# Altium project RPI GPIO BOARD.PrjPcb
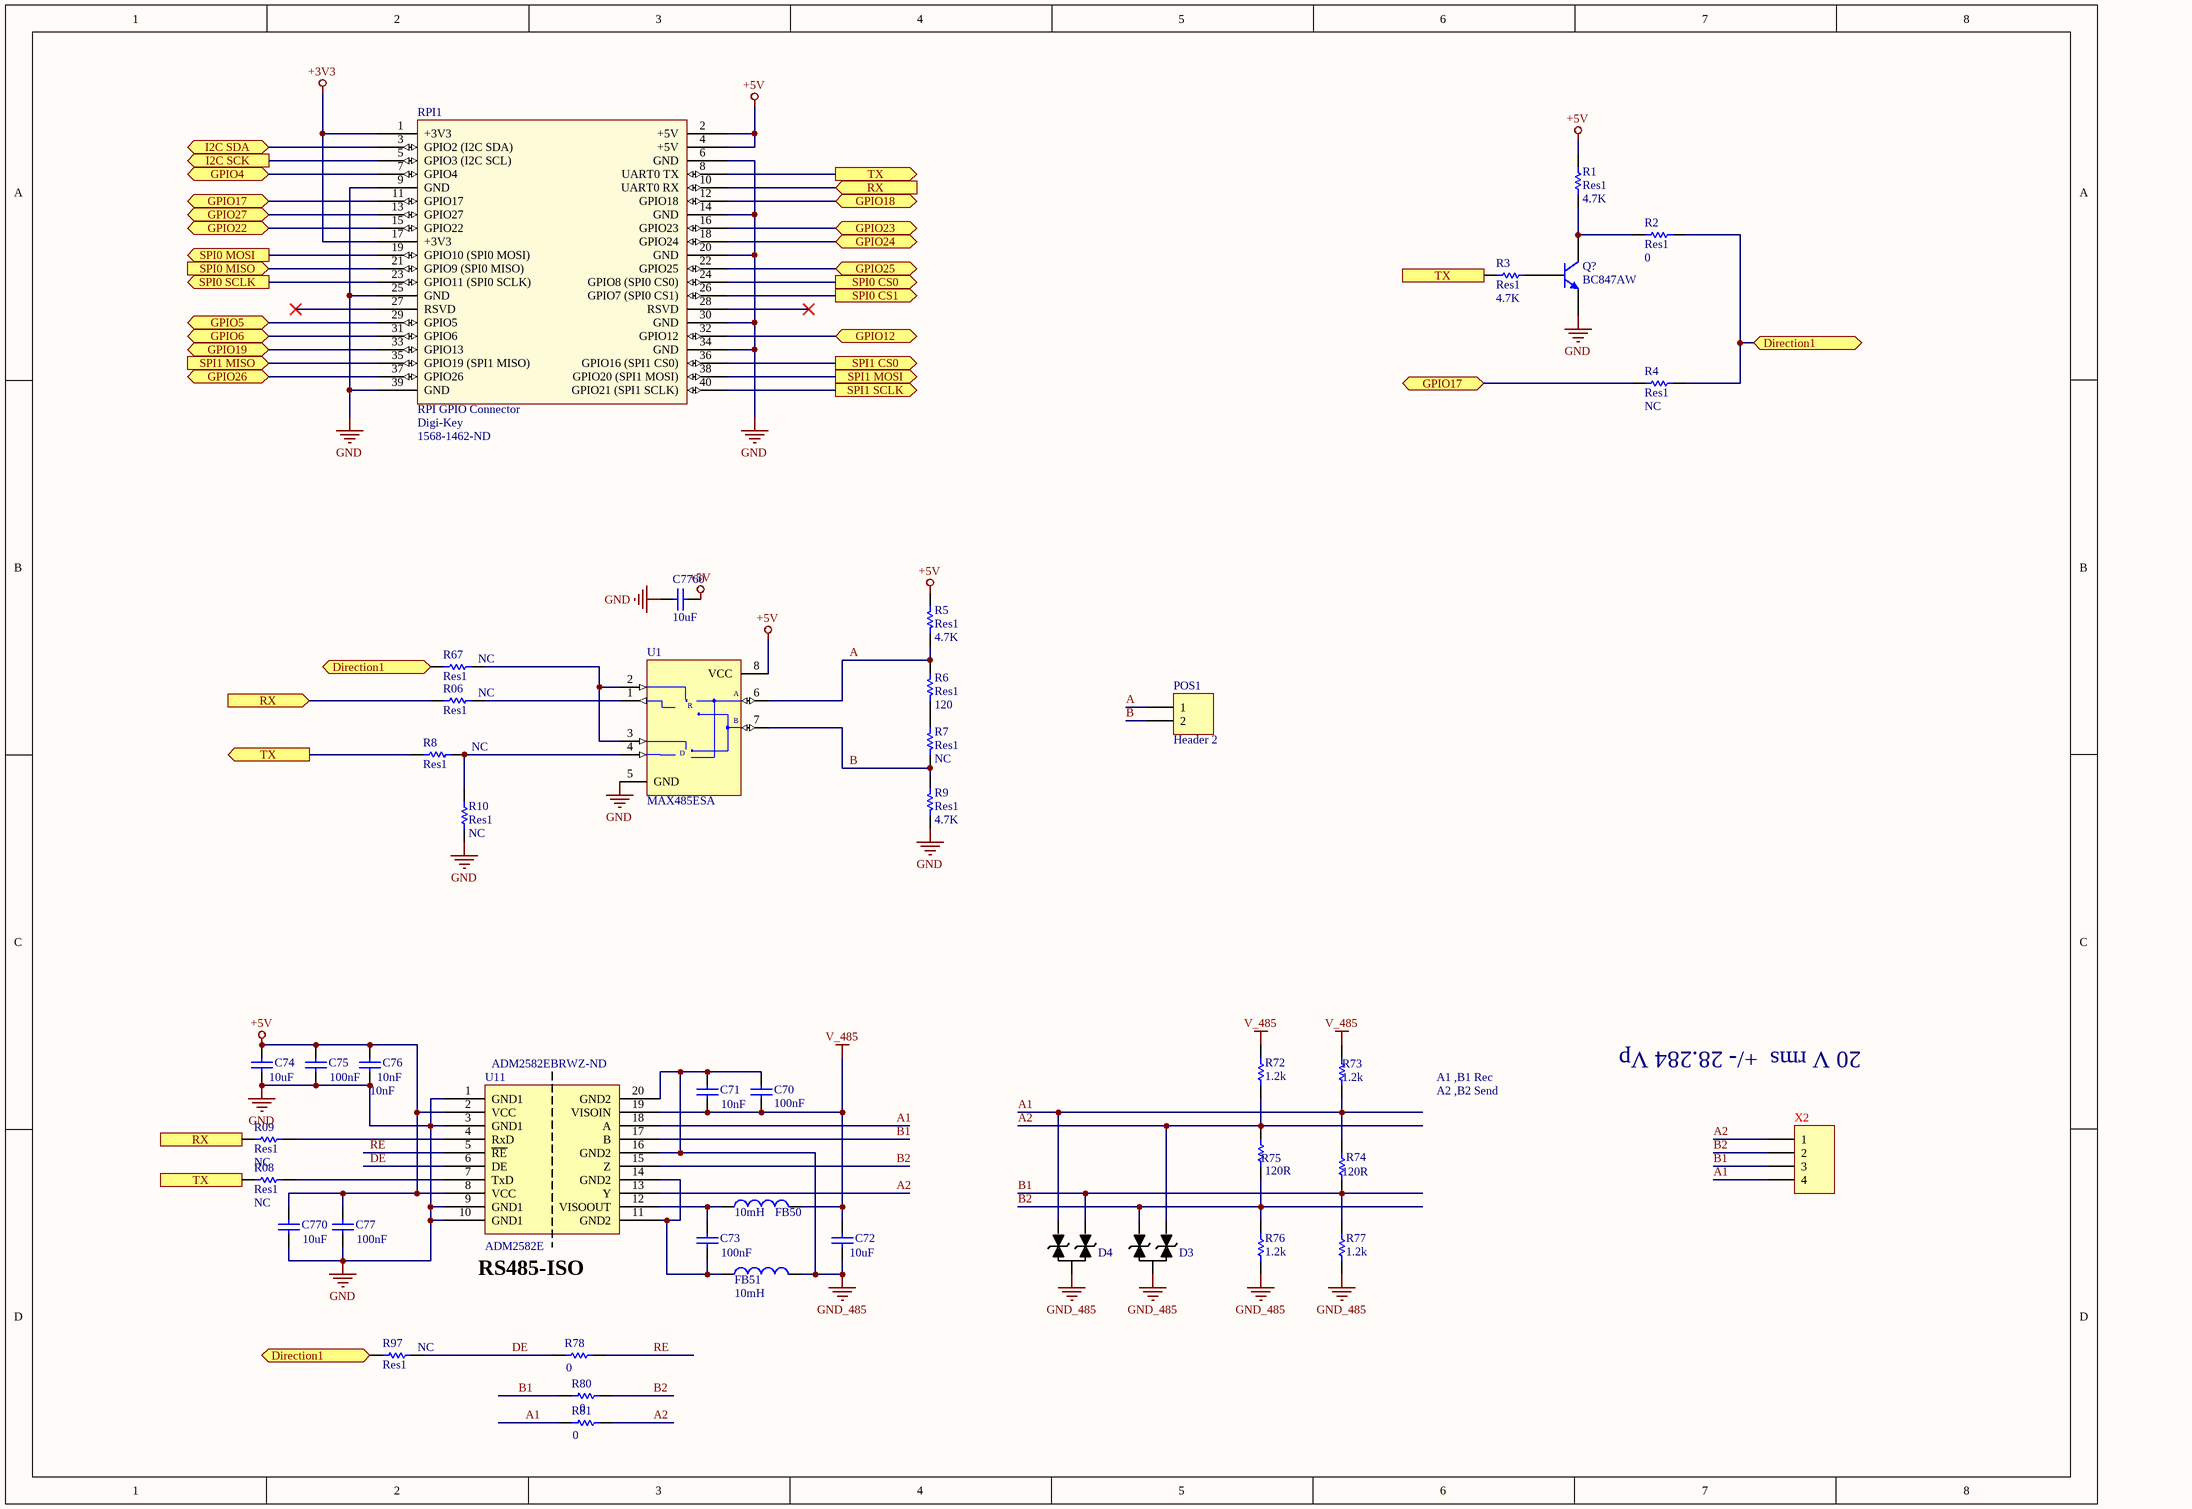
[diagram p0: RPI 3.SchDoc]
mProjectAuthor: Nils Minor; mProjectName: RPI BOARD; mProjectRevision: 0; mProjectVersion: 1
1 sheet, 44 parts. Net scope: flat (ports and power ports of the same name join across sheets).
Board file: RPI 3.PcbDoc

## Sheet RPI 3.SchDoc
size A3; SheetNumber: 1; SheetTotal: 1

### Parts
C70  value 100nF  [0603_LGP]  (hidden comment: 1nF)
C71  10nF  [1206]
C72  10uf  [1206]
C73  100nF  [0603_LGP]
C74  10uF  [1206]
C75  100nF  [0603_LGP]
C76  10nF  [0603_LGP]
C77  100nF  [0603_LGP]
C770  10uF  [0603_LGP]
C7760  10uF  [0603_LGP]
D3  CDSOT23-SM712  [SOT-23A_N]  (value not drawn)
D4  CDSOT23-SM712  [SOT-23A_N]  (value not drawn)
FB50  value 10mH  [0603_LGP]
FB51  value 10mH  [0603_LGP]
POS1  Header 2  [PHOENIX_RIGHT_A_2]
Q?  BC847AW  [SOT-23A_N]
R1  Res1  value 4.7K  [0603_LGP]
R2  Res1  value 0  [0603_LGP]
R3  Res1  value 4.7K  [0603_LGP]
R4  Res1  value NC  [0603_LGP]
R5  Res1  value 4.7K  [1206]
R6  Res1  value 120  [1206]
R06  Res1  value NC  [0603_LGP]
R7  Res1  value NC  [1206]
R8  Res1  value NC  [0603_LGP]
R08  Res1  value NC  [0603_LGP]
R9  Res1  value 4.7K  [1206]
R09  Res1  value NC  [0603_LGP]
R10  Res1  value NC  [0603_LGP]
R67  Res1  value NC  [0603_LGP]
R72  1.2k  [0603_LGP]
R73  1.2k  [0603_LGP]
R74  120R  [0603_LGP]
R75  120R  [0603_LGP]
R76  1.2k  [0603_LGP]
R77  1.2k  [0603_LGP]
R78  0  [0603_LGP]
R80  0  [0603_LGP]
R81  0  [0603_LGP]
R97  Res1  value NC  [0603_LGP]
RPI1  RPI GPIO Connector  Supplier 1: Digi-Key  Supplier Part Number 1: 1568-1462-ND  [rpi]
U1  MAX485ESA  [NSO8_N]
U11  ADM2582E  Supplier Part Number 1: ADM2582EBRWZ-ND  [SO20_W]
X2  1757268  [PHOENIX_RIGHT_A_4]  (value not drawn)

### Ports
Direction1, GPIO4 (bidir), GPIO5 (bidir), GPIO6 (bidir), GPIO12 (bidir), GPIO17 (bidir), GPIO18 (bidir), GPIO19 (bidir), GPIO22 (bidir), GPIO23 (bidir), GPIO24 (bidir), GPIO25 (bidir), GPIO26 (bidir), GPIO27 (bidir), I2C SCK (out), I2C SDA (bidir), RX (in), SPI0 CS0 (out), SPI0 CS1 (out), SPI0 MISO (in), SPI0 MOSI (out), SPI0 SCLK (out), SPI1 CS0 (out), SPI1 MISO (in), SPI1 MOSI (out), SPI1 SCLK (out), TX (out)

### Nets
+3V3: RPI1.1(+3V3) RPI1.17(+3V3)
+5V: C74.1 C75.2 C76.2 C77.2 C770.2 C7760.1 R1.2 R5.2 RPI1.2(+5V) RPI1.4(+5V) U1.8(VCC) U11.2(VCC) U11.8(VCC)
GND: C74.2 C75.1 C76.1 C77.1 C770.1 C7760.2 Q?.2(E) R9.1 R10.2 RPI1.6(GND) RPI1.9(GND) RPI1.14(GND) RPI1.20(GND) RPI1.25(GND) RPI1.30(GND) RPI1.34(GND) RPI1.39(GND) U1.5(GND) U11.1(GND1) U11.3(GND1) U11.9(GND1) U11.10(GND1)
GND_485: C70.2 C71.1 C72.2 D3.3 D4.3 FB51.2 R76.2 R77.2 U11.16(GND2) U11.20(GND2)
V_485: C70.1 C71.2 C72.1 FB50.2 R72.2 R73.2 U11.19(VISOIN)
A: POS1.1 R5.1 R6.2 U1.6(A)
A1: D4.1 R73.1 R74.2 R81.1 U11.18(A) X2.4
A2: D3.2 R72.1 R75.1 R81.2 U11.13(Y) X2.1
B: POS1.2 R7.1 R9.2 U1.7(B)
B1: D4.2 R74.1 R77.1 R80.1 U11.17(B) X2.3
B2: D3.1 R75.2 R76.1 R80.2 U11.15(Z) X2.2
DE: R78.1 R97.2 U11.6(DE)
RE: R78.2 U11.5(~{RE})
NetC73_1: C73.1 FB50.1 U11.12(VISOOUT)
NetC73_2: C73.2 FB51.1 U11.11(GND2) U11.14(GND2)
NetQ?_1: Q?.1(B) R3.2
NetQ?_3: Q?.3(C) R1.1 R2.2
NetR2_1: R2.1 R4.2 R67.1 R97.1 ; port Direction1
NetR3_1: R3.1 R8.1 R08.1 RPI1.8(UART0_TX) ; port TX
NetR4_1: R4.1 RPI1.11(GPIO17) ; port GPIO17
NetR06_1: R06.1 R09.1 RPI1.10(UART0_RX) ; port RX
NetR6_1: R6.1 R7.2
NetR06_2: R06.2 U1.1(RO)
NetR8_2: R8.2 R10.1 U1.4(DI)
NetR08_2: R08.2 U11.7(TxD)
NetR09_2: R09.2 U11.4(RxD)
NetR67_2: R67.2 U1.2(~{RE}) U1.3(DE)
NetRPI1_3: RPI1.3(GPIO2_(I2C_SDA)) ; port I2C SDA
NetRPI1_5: RPI1.5(GPIO3_(I2C_SCL)) ; port I2C SCK
NetRPI1_7: RPI1.7(GPIO4) ; port GPIO4
NetRPI1_12: RPI1.12(GPIO18) ; port GPIO18
NetRPI1_13: RPI1.13(GPIO27) ; port GPIO27
NetRPI1_15: RPI1.15(GPIO22) ; port GPIO22
NetRPI1_16: RPI1.16(GPIO23) ; port GPIO23
NetRPI1_18: RPI1.18(GPIO24) ; port GPIO24
NetRPI1_19: RPI1.19(GPIO10_(SPI0_MOSI)) ; port SPI0 MOSI
NetRPI1_21: RPI1.21(GPIO9_(SPI0_MISO)) ; port SPI0 MISO
NetRPI1_22: RPI1.22(GPIO25) ; port GPIO25
NetRPI1_23: RPI1.23(GPIO11_(SPI0_SCLK)) ; port SPI0 SCLK
NetRPI1_24: RPI1.24(GPIO8_(SPI0_CS0)) ; port SPI0 CS0
NetRPI1_26: RPI1.26(GPIO7_(SPI0_CS1)) ; port SPI0 CS1
NetRPI1_29: RPI1.29(GPIO5) ; port GPIO5
NetRPI1_31: RPI1.31(GPIO6) ; port GPIO6
NetRPI1_32: RPI1.32(GPIO12) ; port GPIO12
NetRPI1_33: RPI1.33(GPIO13) ; port GPIO19
NetRPI1_35: RPI1.35(GPIO19_(SPI1_MISO)) ; port SPI1 MISO
NetRPI1_36: RPI1.36(GPIO16_(SPI1_CS0)) ; port SPI1 CS0
NetRPI1_37: RPI1.37(GPIO26) ; port GPIO26
NetRPI1_38: RPI1.38(GPIO20_(SPI1_MOSI)) ; port SPI1 MOSI
NetRPI1_40: RPI1.40(GPIO21_(SPI1_SCLK)) ; port SPI1 SCLK

Not connected (* = marked no-connect by the designer): RPI1 27(RSVD)* 28(RSVD)*

### Notes on the sheet
- 20 V rms  +/- 28.284 Vp
- A1 ,B1 Rec
- A2 ,B2 Send
- (near U11) RS485-ISO
- (in symbol MAX485ESA) R; D

### Library data of the parts
C70 = Cap Semi: Multilayer Ceramic Capacitors MLCC - SMD/SMT 16volts 0.1uF 5% X7R; Manufacturer: KEMET; Manufacturer Part Number: C0603C104J4RAC; Part # Aliases: C0603C104J4RAC7867; Capacitance - nF: 100 nF; Capacitance - pF: 100000 pF; Case Height: 0.8 mm; Case Length: 1.6 mm; Class: Class 1; Dissipation Factor DF: 3.5; Voltage Rating: 16 V; Temperature Coefficient / Code: +/- 15 %; Type: SMD MLCC X7R 6.3 - 250 VDC Commerical Grade; Published: 8-Jun-2000; LatestRevisionDate: 29-May-2009; LatestRevisionNote: IPC-7351 Footprint Added.; PackageReference: C1206; Publisher: Altium Limited; PackageDescription: Chip Capacitor; Supplier 1: Arrow; Supplier Part Number 1: C0603C104J4RAC; Stock 1: 96; Pricing 1: 1=0.09, 10=0.0816, 100=0.0801, 500=0.0795 (USD); Brand: Kemet; Capacitance: 0.1 uF; Case Code - in: 0603; Case Code - mm: 1608; Dimensions: 0.8 mm W x 1.6 mm L x 0.8 mm H; Dielectric: X7R; Case Width: 0.8 mm; Factory Pack Quantity: 4000; Product Category: Multilayer Ceramic Capacitors MLCC - SMD/SMT; RoHS: Details; Tolerance: 5 %; Minimum Operating Temperature: - 55 C; Maximum Operating Temperature: + 125 C; Product: General Type MLCCs; Operating Temperature Range: - 55 C to + 125 C; Package / Case: 0603 (1608 metric); Packaging: Reel; Series: C0603C; Termination Style: SMD/SMT; Voltage Rating DC: 16 V; ComponentLink1URL: http://www.kemet.com/Lists/ProductCatalog/Attachments/53/KEM_C1002_X7R_SMD.pdf; ComponentLink1Description: http://www.kemet.com/Lists/ProductCatalog/Attachments/53/KEM_C1002_X7R_SMD.pdf
C71 C76 = Cap: Cap Ceramic 0.01uF 25V X7R 10% SMD 0603 125C Paper T/R; Manufacturer: KEMET; Manufacturer Part Number: C0603C103K3RACTU; SVHC: To Be Advised; Product Range: KEMET - C Series; Capacitance: 0.01µF; Capacitor Case Style: 0603 [1608 Metric]; Published: 8-Jun-2000; LatestRevisionDate: 17-Jul-2002; LatestRevisionNote: Re-released for DXP Platform.; PackageReference: RAD-0.3; Publisher: Altium Limited; PackageDescription: Radial Cap, Thru-Hole; 2 Leads; 0.3 in Pin Spacing; Value: 10nF; Supplier 1: Digi-Key; Supplier Part Number 1: 399-7840-6-ND; Stock 1: 932853; Pricing 1: 1=0.1, 10=0.029, 100=0.013, 500=0.0093, 1000=0.0073 (USD); Capacitance Tolerance: ± 10%; Dielectric Characteristic: X7R; Voltage Rating: 25V; Operating Temperature Min: -55°C; Operating Temperature Max: 125°C; Packaging: Tape & Reel; ComponentLink1URL: https://datasheet.ciiva.com/46385/1851736-46385372.pdf; ComponentLink1Description: https://datasheet.ciiva.com/46385/1851736-46385372.pdf; ComponentLink2URL: https://datasheet.ciiva.com/14589/70095383-14589438.pdf; ComponentLink2Description: https://datasheet.ciiva.com/14589/70095383-14589438.pdf; ComponentLink3URL: https://datasheet.ciiva.com/14609/70095383-14609646.pdf; ComponentLink3Description: https://datasheet.ciiva.com/14609/70095383-14609646.pdf; ComponentLink4URL: https://datasheet.ciiva.com/7823/kem-c1002-x7r-smd-7823974.pdf; ComponentLink4Description: https://datasheet.ciiva.com/7823/kem-c1002-x7r-smd-7823974.pdf; ComponentLink5URL: https://datasheet.ciiva.com/5904/kem-c1002-x7r-smd-5904903.pdf; ComponentLink5Description: https://datasheet.ciiva.com/5904/kem-c1002-x7r-smd-5904903.pdf; ComponentLink6URL: https://datasheet.ciiva.com/46448/1851736-46448649.pdf; ComponentLink6Description: https://datasheet.ciiva.com/46448/1851736-46448649.pdf
C72 C74 = Cap: Multilayer Ceramic Capacitors MLCC - SMD/SMT 10uF 25 Volts 10% X7R    Learn More; Manufacturer: KEMET; Manufacturer Part Number: C1206C106K3RACTU; Capacitance: 10µF; Voltage - Rated: 25V; Online Catalog: X7R Dielectric (Commercial Grade); Other Names: 399-7442-6; Published: 8-Jun-2000; LatestRevisionDate: 17-Jul-2002; LatestRevisionNote: Re-released for DXP Platform.; PackageReference: RAD-0.3; Publisher: Altium Limited; PackageDescription: Radial Cap, Thru-Hole; 2 Leads; 0.3 in Pin Spacing; Value: 10uF; Supplier 1: Digi-Key; Supplier Part Number 1: 399-7442-6-ND; Stock 1: 156580; Pricing 1: 1=0.73, 10=0.513, 100=0.3381, 500=0.2505, 1000=0.2129 (USD); Standard Package: 1; Category: Capacitors; Family: Ceramic Capacitors; Series: C; Packaging: Digi-Reel®; Tolerance: ±10%; Temperature Coefficient: X7R; Mounting Type: Surface Mount, MLCC; Operating Temperature: -55°C ~ 125°C; Applications: General Purpose; Ratings: -; Package / Case: 1206 (3216 Metric); Size / Dimension: 0.126" L x 0.063" W (3.20mm x 1.60mm); Height - Seated (Max): -; Thickness (Max): 0.071" (1.80mm); Lead Spacing: -; Features: -; Lead Style: -; ComponentLink1URL: https://datasheet.ciiva.com/22704/1851736-22704888.pdf; ComponentLink1Description: https://datasheet.ciiva.com/22704/1851736-22704888.pdf; ComponentLink2URL: https://datasheet.ciiva.com/7729/1851736-7729817.pdf; ComponentLink2Description: https://datasheet.ciiva.com/7729/1851736-7729817.pdf; ComponentLink3URL: https://datasheet.ciiva.com/18194/getdatasheetpartid-713319-18194197.pdf; ComponentLink3Description: https://datasheet.ciiva.com/18194/getdatasheetpartid-713319-18194197.pdf; ComponentLink4URL: https://datasheet.ciiva.com/5409/kem-c1002-x7r-smd-5409592.pdf; ComponentLink4Description: https://datasheet.ciiva.com/5409/kem-c1002-x7r-smd-5409592.pdf
C73 C75 C77 = Cap: Multilayer Ceramic Capacitors MLCC - SMD/SMT 16volts 0.1uF 5% X7R; Manufacturer: KEMET; Manufacturer Part Number: C0603C104J4RAC; Part # Aliases: C0603C104J4RAC7867; Capacitance - pF: 100000 pF; Case Height: 0.8 mm; Case Length: 1.6 mm; Class: Class 1; Dissipation Factor DF: 3.5; Voltage Rating: 16 V; Temperature Coefficient / Code: +/- 15 %; Type: SMD MLCC X7R 6.3 - 250 VDC Commerical Grade; Published: 8-Jun-2000; LatestRevisionDate: 17-Jul-2002; LatestRevisionNote: Re-released for DXP Platform.; PackageReference: RAD-0.3; Publisher: Altium Limited; PackageDescription: Radial Cap, Thru-Hole; 2 Leads; 0.3 in Pin Spacing; Value: 100nF; Supplier 1: Arrow; Supplier Part Number 1: C0603C104J4RAC; Stock 1: 96; Pricing 1: 1=0.09, 10=0.0816, 100=0.0801, 500=0.0795 (USD); Brand: Kemet; Capacitance: 0.1 uF; Capacitance - nF: 100 nF; Case Code - in: 0603; Case Code - mm: 1608; Dimensions: 0.8 mm W x 1.6 mm L x 0.8 mm H; Dielectric: X7R; Case Width: 0.8 mm; Factory Pack Quantity: 4000; Product Category: Multilayer Ceramic Capacitors MLCC - SMD/SMT; RoHS: Details; Tolerance: 5 %; Minimum Operating Temperature: - 55 C; Maximum Operating Temperature: + 125 C; Product: General Type MLCCs; Operating Temperature Range: - 55 C to + 125 C; Package / Case: 0603 (1608 metric); Packaging: Reel; Series: C0603C; Termination Style: SMD/SMT; Voltage Rating DC: 16 V; ComponentLink1URL: http://www.kemet.com/Lists/ProductCatalog/Attachments/53/KEM_C1002_X7R_SMD.pdf; ComponentLink1Description: http://www.kemet.com/Lists/ProductCatalog/Attachments/53/KEM_C1002_X7R_SMD.pdf
C770 C7760 = Cap: Multilayer Ceramic Capacitors MLCC - SMD/SMT 16volts 0.1uF 5% X7R; Manufacturer: KEMET; Manufacturer Part Number: C0603C104J4RAC; Part # Aliases: C0603C104J4RAC7867; Capacitance - nF: 100 nF; Capacitance - pF: 100000 pF; Case Height: 0.8 mm; Case Length: 1.6 mm; Class: Class 1; Dissipation Factor DF: 3.5; Voltage Rating: 16 V; Temperature Coefficient / Code: +/- 15 %; Type: SMD MLCC X7R 6.3 - 250 VDC Commerical Grade; Published: 8-Jun-2000; LatestRevisionDate: 17-Jul-2002; LatestRevisionNote: Re-released for DXP Platform.; PackageReference: RAD-0.3; Publisher: Altium Limited; PackageDescription: Radial Cap, Thru-Hole; 2 Leads; 0.3 in Pin Spacing; Value: 10uF; Supplier 1: Arrow; Supplier Part Number 1: C0603C104J4RAC; Stock 1: 96; Pricing 1: 1=0.09, 10=0.0816, 100=0.0801, 500=0.0795 (USD); Brand: Kemet; Capacitance: 0.1 uF; Case Code - in: 0603; Case Code - mm: 1608; Dimensions: 0.8 mm W x 1.6 mm L x 0.8 mm H; Dielectric: X7R; Case Width: 0.8 mm; Factory Pack Quantity: 4000; Product Category: Multilayer Ceramic Capacitors MLCC - SMD/SMT; RoHS: Details; Tolerance: 5 %; Minimum Operating Temperature: - 55 C; Maximum Operating Temperature: + 125 C; Product: General Type MLCCs; Operating Temperature Range: - 55 C to + 125 C; Package / Case: 0603 (1608 metric); Packaging: Reel; Series: C0603C; Termination Style: SMD/SMT; Voltage Rating DC: 16 V; ComponentLink1URL: http://www.kemet.com/Lists/ProductCatalog/Attachments/53/KEM_C1002_X7R_SMD.pdf; ComponentLink1Description: http://www.kemet.com/Lists/ProductCatalog/Attachments/53/KEM_C1002_X7R_SMD.pdf
D3 D4 = SM712: TVS DIODE 7VWM/12VWM SOT23; Manufacturer: Bourns; Product Training Modules: ESD Protection Products; Catalog Drawings: CDSOT23-SM712 Schematic; Type: Zener; Bidirectional Channels: 2; Voltage - Reverse Standoff (Typ): 7V (Max), 12V (Max); Voltage - Breakdown (Min): 7.5V, 13.3V; Voltage - Clamping (Max) @ Ipp: 14V, 26V; Current - Peak Pulse (10/1000µs): 17A (8/20µs); Power - Peak Pulse: 400W; Power Line Protection: No; Capacitance @ Frequency: 75pF @ 1MHz; Online Catalog: CDSOT23 Series; Kits: PN-DESIGNKIT-22-ND  - KIT ESD/EFT SURGE PROTECTION; For Use With: EVAL-CN0313-SDPZ-ND  - EVAL EMC RS-485 CERTIFIED; Related Products: ADM3485EARZ-REEL7TR-ND  - IC TXRX RS-485 HS 3.3V 8SOIC ADM3485EARZ-REEL7CT-ND  - IC TXRX RS-485 HS 3.3V 8SOIC ADM3485EARZ-REEL7DKR-ND  - IC TXRX RS-485 HS 3.3V 8SOIC ADM3485EARZ-ND  - IC TX/RX RS-485 HS 3.3V 8-SOIC ADM3485EAR-ND  - IC TX/RX RS-485 HS 3.3V 8-SOIC 296-38503-5-ND  - IC TXRX RS485 3.3V ESD 14SOIC 296-38501-5-ND  - IC RS485 TXRX 3.3 ESD 8SOIC 296-38522-5-ND  - IC TXRX RS485 3.3V 14SOIC 296-38502-5-ND  - IC TXRX RS485 3.3V ESD 14SOIC ADM3485EARZ-REELTR-ND  - IC TXRX RS-485 3.3V 8SOIC ADM3485EARZ-REELCT-ND  - IC TXRX RS-485 3.3V 8SOIC ADM3485EARZ-REELDKR-ND  - IC TXRX RS-485 3.3V 8SOIC 296-40517-2-ND  - IC TXRX RS485 3.3V 14SOIC 296-40517-1-ND  - IC TXRX RS485 3.3V 14SOIC 296-40517-6-ND  - IC TXRX RS485 3.3V 14SOIC 296-40519-2-ND  - IC RS485 TXRX 3.3 ESD 8SOIC 296-40519-1-ND  - IC RS485 TXRX 3.3 ESD 8SOIC 296-40519-6-ND  - IC RS485 TXRX 3.3 ESD 8SOIC 296-40524-2-ND  - IC TXRX RS485 3.3V ESD 8SOIC 296-40524-1-ND  - IC TXRX RS485 3.3V ESD 8SOIC 296-40524-6-ND  - IC TXRX RS485 3.3V ESD 8SOIC 296-40522-2-ND  - IC TXRX RS485 3.3V ESD 14SOIC 296-40522-1-ND  - IC TXRX RS485 3.3V ESD 14SOIC 296-40522-6-ND  - IC TXRX RS485 3.3V ESD 14SOIC 296-40529-2-ND  - IC RS485 TXRX 3.3 ESD 8SOIC 296-40529-1-ND  - IC RS485 TXRX 3.3 ESD 8SOIC 296-40529-6-ND  - IC RS485 TXRX 3.3 ESD 8SOIC 296-40527-2-ND  - IC TXRX RS485 FULL DUPLEX 14SOIC 296-40527-1-ND  - IC TXRX RS485 FULL DUPLEX 14SOIC 296-40527-6-ND  - IC TXRX RS485 FULL DUPLEX 14SOIC 296-40516-2-ND  - IC TXRX RS485 3.3V 10VSSOP 296-40516-1-ND  - IC TXRX RS485 3.3V 10VSSOP 296-40516-6-ND  - IC TXRX RS485 3.3V 10VSSOP 296-40518-2-ND  - IC RS485 TXRX 3.3 ESD 8VSSOP 296-40518-1-ND  - IC RS485 TXRX 3.3 ESD 8VSSOP 296-40518-6-ND  - IC RS485 TXRX 3.3 ESD 8VSSOP 296-40521-2-ND  - IC TXRX RS485 3.3V ESD 10VSSOP 296-40521-1-ND  - IC TXRX RS485 3.3V ESD 10VSSOP 296-40521-6-ND  - IC TXRX RS485 3.3V ESD 10VSSOP 296-40523-2-ND  - IC TXRX RS485 3.3V ESD 8VSSOP 296-40523-1-ND  - IC TXRX RS485 3.3V ESD 8VSSOP 296-40523-6-ND  - IC TXRX RS485 3.3V ESD 8VSSOP 296-40528-2-ND  - IC RS485 TXRX 3.3 ESD 8VSSOP 296-40528-1-ND  - IC RS485 TXRX 3.3 ESD 8VSSOP 296-40528-6-ND  - IC RS485 TXRX 3.3 ESD 8VSSOP 296-40526-2-ND  - IC TXRX RS485 FULL DUPLEX 10VSSO 296-40526-1-ND  - IC TXRX RS485 FULL DUPLEX 10VSSO 296-40526-6-ND  - IC TXRX RS485 FULL DUPLEX 10VSSO SN65HVD74DGK-ND  - IC TXRX RS485 3.3V ESD 8VSSOP; Other Names: CDSOT23-SM712CT; Supplier 1: Digi-Key; Supplier Part Number 1: CDSOT23-SM712CT-ND; Manufacturer Part Number: CDSOT23-SM712; Stock 1: 100355; Pricing 1: 1=1.62, 10=1.437, 25=1.298, 100=1.1356, 250=0.9965, 500=0.8807, 1000=0.6953 (USD); Standard Package: 1; Category: Circuit Protection; Family: TVS - Diodes; Series: -; Packaging: Cut Tape (CT); Unidirectional Channels: -; Applications: General Purpose; Operating Temperature: -55°C ~ 150°C (TJ); Mounting Type: Surface Mount; Package / Case: TO-236-3, SC-59, SOT-23-3; Supplier Device Package: SOT-23-3; ComponentLink1URL: https://datasheet.ciiva.com/11193/cdsot23-sm712-11193846.pdf; ComponentLink1Description: https://datasheet.ciiva.com/11193/cdsot23-sm712-11193846.pdf; ComponentLink2URL: https://datasheet.ciiva.com/16582/cdsot23-sm712-16582189.pdf; ComponentLink2Description: https://datasheet.ciiva.com/16582/cdsot23-sm712-16582189.pdf; ComponentLink3URL: https://datasheet.ciiva.com/1281/1670933-1281331.pdf; ComponentLink3Description: https://datasheet.ciiva.com/1281/1670933-1281331.pdf; ComponentLink4URL: https://datasheet.ciiva.com/4510/cdsot23-sm712-25932-4510261.pdf; ComponentLink4Description: https://datasheet.ciiva.com/4510/cdsot23-sm712-25932-4510261.pdf; ComponentLink5URL: https://datasheet.ciiva.com/337/cdsot23-sm712-337452.pdf; ComponentLink5Description: https://datasheet.ciiva.com/337/cdsot23-sm712-337452.pdf; ComponentLink6URL: https://datasheet.ciiva.com/26828/getdatasheetpartid-418501-26828522.pdf; ComponentLink6Description: https://datasheet.ciiva.com/26828/getdatasheetpartid-418501-26828522.pdf; ComponentLink7URL: https://datasheet.ciiva.com/337/cdsot23-sm712-337451.pdf; ComponentLink7Description: https://datasheet.ciiva.com/337/cdsot23-sm712-337451.pdf; ComponentLink8URL: https://datasheet.ciiva.com/22696/1670933-22696779.pdf; ComponentLink8Description: https://datasheet.ciiva.com/22696/1670933-22696779.pdf
FB50 FB51 = Inductor: Code_IEC: 1005; Published: 8-Jun-2000; LatestRevisionDate: 29-May-2009; LatestRevisionNote: IPC-7351 Footprint Added.; PackageReference: 0402-A; Publisher: Altium Limited; PackageDescription: Chip Inductor; Code_JEITA: 0402
POS1 = Header 2: Header, 2-Pin; LatestRevisionDate: 17-Jul-2002; LatestRevisionNote: Re-released for DXP Platform.; Publisher: Altium Limited
Q? = BC847AW: NPN General-purpose Transistor; Published: 17-Sep-2003; LatestRevisionDate: 12-Dec-2006; LatestRevisionNote: IPC-7351 Footprint Added.; DatasheetVersion: 4-Feb-2002; PackageVersion: Apr-1999; PackageReference: SOT323; Publisher: Altium Limited; PackageDescription: 3-Pin SOT-323 Package 0.65 mm Pitch, 2.1 mm Lead Span; ComponentLink1Description: Manufacturer Link; ComponentLink1URL: http://www.semiconductors.philips.com/; ComponentLink2Description: Datasheet; ComponentLink2URL: http://www.semiconductors.philips.com/acrobat/datasheets/BC846W_BC847W_BC848W_4.pdf
R1-R6 R06-R8 R08 R9 R09 R10 R67 R97 = Res1: Resistor; Published: 8-Jun-2000; LatestRevisionDate: 17-Jul-2002; LatestRevisionNote: Re-released for DXP Platform.; PackageReference: AXIAL-0.3; Publisher: Altium Limited; PackageDescription: Axial Device, Thru-Hole; 2 Leads; 0.3 in Pin Spacing
R72 R73 R76 R77 = Res Semi: Res Thick Film 0603 1.2K Ohm 1% 0.1W(1/10W) ±100ppm/C Molded SMD Automotive Paper T/R; Manufacturer: Vishay; Manufacturer Part Number: CRCW06031K20FKEC; Power (Watts): 0.1W, 1/10W; Temperature Coefficient: ±100ppm/°C; Published: 8-Jun-2010; LatestRevisionDate: 17-Jul-2002; LatestRevisionNote: Re-released for DXP Platform.; Publisher: Altium Limited; Value: 1.2k; Supplier 1: Digi-Key; Supplier Part Number 1: CRCW06031K20FKEC-ND; Stock 1: 0; Pricing 1: 20000=0.0036, 40000=0.0032, 60000=0.0029, 100000=0.0029 (USD); Standard Package: 20,000; Category: Resistors; Family: Chip Resistor - Surface Mount; Series: CRCW; Packaging: Tape &amp; Reel (TR); Resistance (Ohms): 1.2k; Tolerance: ±1%; Composition: Thick Film; Features: Automotive AEC-Q200; Operating Temperature: -55°C ~ 155°C; Package / Case: 0603 (1608 Metric); Supplier Device Package: 0603; Size / Dimension: 0.061" L x 0.033" W (1.55mm x 0.85mm); Height: 0.020" (0.50mm); Number of Terminations: 2; ComponentLink1URL: http://components.arrow.com/part/dataview/0323_04154042; ComponentLink1Description: http://components.arrow.com/part/dataview/0323_04154042; ComponentLink2URL: http://www.vishay.com/docs/20035/dcrcwe3.pdf; ComponentLink2Description: http://www.vishay.com/docs/20035/dcrcwe3.pdf
R74 R75 = Res Semi: Res Thick Film 0603 562 Ohm 1% 0.1W(1/10W) ±100ppm/C Molded SMD Automotive Paper T/R; Manufacturer: Vishay; Manufacturer Part Number: CRCW0603562RFKEA; Brand: Vishay / Dale; Resistance: 562 Ohms; Power Rating: 100 mW; Temperature Coefficient: 100 PPM / K; Voltage Rating: 75 V; Unit Weight: 0.000071 oz; Published: 8-Jun-2010; LatestRevisionDate: 17-Jul-2002; LatestRevisionNote: Re-released for DXP Platform.; Publisher: Altium Limited; Value: 120R; Supplier 1: Digi-Key; Supplier Part Number 1: 541-562HTR-ND; Stock 1: 0; Pricing 1: 5000=0.0042, 10000=0.0036, 25000=0.0032, 50000=0.0029, 125000=0.0029 (USD); Product Category: Thick Film Resistors - SMD; RoHS: Details; Tolerance: 1 %; Case Code - in: 0603; Case Code - mm: 1608; Operating Temperature Range: - 55 C to + 155 C; Series: CRCW; Height: 0.45 mm; Length: 1.55 mm; Package / Case: 0603 (1608 metric); Packaging: Reel; Product: Thick Film Resistors SMD; Factory Pack Quantity: 5000; Termination Style: SMD/SMT; Width: 0.85 mm; ComponentLink1URL: https://datasheet.ciiva.com/11810/0900766b80d98afc-11810929.pdf; ComponentLink1Description: https://datasheet.ciiva.com/11810/0900766b80d98afc-11810929.pdf; ComponentLink2URL: https://datasheet.ciiva.com/16391/dcrcw-16391085.pdf; ComponentLink2Description: https://datasheet.ciiva.com/16391/dcrcw-16391085.pdf; ComponentLink3URL: https://datasheet.ciiva.com/16778/70201119-16778669.pdf; ComponentLink3Description: https://datasheet.ciiva.com/16778/70201119-16778669.pdf; ComponentLink4URL: https://datasheet.ciiva.com/16883/dcrcwe3-16883893.pdf; ComponentLink4Description: https://datasheet.ciiva.com/16883/dcrcwe3-16883893.pdf; ComponentLink5URL: https://datasheet.ciiva.com/7882/1533075-7882061.pdf; ComponentLink5Description: https://datasheet.ciiva.com/7882/1533075-7882061.pdf; Supplier 2: Digi-Key; Supplier Part Number 2: 541-120HTR-ND; Stock 2: 0; Pricing 2: 5000=0.0042, 10000=0.0036, 25000=0.0032, 50000=0.0029, 125000=0.0029 (USD); ComponentLink6URL: https://datasheet.ciiva.com/11811/0900766b80d98afc-11811523.pdf; ComponentLink6Description: https://datasheet.ciiva.com/11811/0900766b80d98afc-11811523.pdf; ComponentLink7URL: https://datasheet.ciiva.com/7777/1533075-7777275.pdf; ComponentLink7Description: https://datasheet.ciiva.com/7777/1533075-7777275.pdf; ComponentLink8URL: https://datasheet.ciiva.com/5544/dcrcwe3-109170-5544139.pdf; ComponentLink8Description: https://datasheet.ciiva.com/5544/dcrcwe3-109170-5544139.pdf; ComponentLink9URL: https://datasheet.ciiva.com/16725/70201119-16725181.pdf; ComponentLink9Description: https://datasheet.ciiva.com/16725/70201119-16725181.pdf; ComponentLink10URL: https://datasheet.ciiva.com/7777/1697337-7777276.pdf; ComponentLink10Description: https://datasheet.ciiva.com/7777/1697337-7777276.pdf; ComponentLink11URL: https://datasheet.ciiva.com/2513/dcrcwe3-2513576.pdf; ComponentLink11Description: https://datasheet.ciiva.com/2513/dcrcwe3-2513576.pdf; ComponentLink12URL: https://datasheet.ciiva.com/2513/dcrcwe3-2513575.pdf; ComponentLink12Description: https://datasheet.ciiva.com/2513/dcrcwe3-2513575.pdf; ComponentLink13URL: https://datasheet.ciiva.com/2513/dcrcwe3-2513577.pdf; ComponentLink13Description: https://datasheet.ciiva.com/2513/dcrcwe3-2513577.pdf; ComponentLink14URL: https://datasheet.ciiva.com/26316/fld-crcw-e3-data-en-26316568.pdf; ComponentLink14Description: https://datasheet.ciiva.com/26316/fld-crcw-e3-data-en-26316568.pdf
R78 R80 R81 = Res Semi: Res Thick Film 0603 0 Ohm Molded SMD Automotive Paper T/R; Manufacturer: Vishay Dale; Manufacturer Part Number: CRCW06030000Z0EC; Power Rating(s): Not RequiredW; Resistance: 0ohm; Tolerance (+ or -): Not Required; Product Length (mm): 1.55mm; Product Depth (mm): 0.85mm; Product Height (mm): 0.45mm; Published: 8-Jun-2010; LatestRevisionDate: 17-Jul-2002; LatestRevisionNote: Re-released for DXP Platform.; Publisher: Altium Limited; Value: 0; Supplier 1: Digi-Key; Supplier Part Number 1: 541-2969-6-ND; Stock 1: 0; Pricing 1: 1=0.1, 10=0.022, 25=0.016, 50=0.0124, 100=0.0091, 250=0.0069, 500=0.0055, 1000=0.0041, 5000=0.0029 (USD); Type: Thick Film; Temperature Coefficient: Not Required; Package / Case: 0603; Packaging: Tape and Reel; Operating Temp Range: -55C to 155C; Case Style: Molded; Military Standard: Not Required; Failure Rate: Not Required; Construction: Rectangular; Termination Style: Not Required; ComponentLink1URL: https://datasheet.ciiva.com/16199/dcrcwe3-16199083.pdf; ComponentLink1Description: https://datasheet.ciiva.com/16199/dcrcwe3-16199083.pdf
RPI1 = rpi connector: GPIO Header for Raspberry Pi A+/B+/Pi 2/Pi 3 - 2x20; Manufacturer: SparkFun Electronics; Manufacturer Part Number: PRT-14017; Nils Minor: author; nilsminor@web.de: mail; RoHS: RoHS Compliant; Category: Development Boards, Kits, Programmers; Stock 1: 150; Pricing 1: 1=1.84 (EUR); Part Status: Active; Accessory Type: Connector; For Use With/Related Products: Raspberry Pi; ComponentLink1URL: https://cdn.sparkfun.com/datasheets/Dev/RaspberryPi/12313.pdf; ComponentLink1Description: https://cdn.sparkfun.com/datasheets/Dev/RaspberryPi/12313.pdf
U1 = MAX485ESA: Low-Power, Slew-Rate-Limited RS-485/RS-422 Transceiver; Published: 16-Jan-2001; LatestRevisionDate: 13-Apr-2006; LatestRevisionNote: IPC-7351 Footprint Added.; DatasheetVersion: Feb-1996; PackageReference: NSO8; Publisher: Altium Limited; PackageDescription: 8-Pin Small Outline Integrated Circuit 1.27 mm Pitch; Code_JEDEC: MS-012-AA; Code_IPC: SOIC127P600-8; ComponentLink1Description: Manufacturer Link; ComponentLink1URL: http://www.maxim-ic.com/; ComponentLink2Description: Datasheet; ComponentLink2URL: http://pdfserv.maxim-ic.com/en/ds/MAX1487-MAX491.pdf
U11 = ADM2582E: Signal and Power Isolated RS-485  Transceiver with ±15 kV ESD Protection; Manufacturer: Analog Devices; Manufacturer Part Number: ADM2582EBRWZ; Other Related Documents: ADI Programmable Log Controller Solutions; Mfg Application Notes: Pressure Transmitter Solutions ADM258xE PCB Implementation Guidelines; PCN Design/Specification: Poly Mask Change 15/Aug/2013; PCN Assembly/Origin: Alternate Assembly Site 22/Sep/2015 Alt Assembly Site Rev/Add  15/Dec/2015; EDA / CAD Models: Download from Accelerated Designs; Isolated Power: Yes; Number of Channels: 3; Inputs - Side 1/Side 2: 2/1; Channel Type: Unidirectional; Voltage - Isolation: 2500Vrms; Common Mode Transient Immunity (Min): 25kV/µs; Data Rate: 16Mbps; Rise / Fall Time (Typ): 15ns, 15ns (Max); Voltage - Supply: 3.3V, 5V; Online Catalog: ADM2582E/ADM2587E Series; For Use With: 1286-1082-ND                                                          - DGTL ISO 2.5KV RS422/RS485 MOD; Supplier 1: Digi-Key; Stock 1: 1920; Pricing 1: 1=14.13, 37=12.4443, 111=10.9643 (USD); Standard Package: 37; Category: Isolators; Family: Digital Isolators; Series: IsoPower®, iCoupler®; Packaging: Tube; Technology: Magnetic Coupling; Type: RS422, RS485; Propagation Delay tpLH / tpHL (Max): -; Pulse Width Distortion (Max): -; Operating Temperature: -40°C ~ 85°C; Package / Case: 20-SOIC (0.295", 7.50mm Width); Supplier Device Package: 20-SOIC; ComponentLink1URL: https://datasheet.ciiva.com/26833/adm2582ebrwz-26833963.pdf; ComponentLink1Description: https://datasheet.ciiva.com/26833/adm2582ebrwz-26833963.pdf; ComponentLink2URL: https://datasheet.ciiva.com/1147/1859540-1147437.pdf; ComponentLink2Description: https://datasheet.ciiva.com/1147/1859540-1147437.pdf; ComponentLink3URL: https://datasheet.ciiva.com/1147/1859540-1147436.pdf; ComponentLink3Description: https://datasheet.ciiva.com/1147/1859540-1147436.pdf; ComponentLink4URL: https://datasheet.ciiva.com/25910/adm2582e-2587e-25910447.pdf; ComponentLink4Description: https://datasheet.ciiva.com/25910/adm2582e-2587e-25910447.pdf; ComponentLink5URL: https://datasheet.ciiva.com/3028/adm2582e-2587e-3028083.pdf; ComponentLink5Description: https://datasheet.ciiva.com/3028/adm2582e-2587e-3028083.pdf; ComponentLink6URL: https://datasheet.ciiva.com/1700/adm2582e-2587e-1700699.pdf; ComponentLink6Description: https://datasheet.ciiva.com/1700/adm2582e-2587e-1700699.pdf; ComponentLink7URL: https://datasheet.ciiva.com/48708/001248351-da-01-en-ic-txrx-rs485-i-adm2582ebrwz-soic-20-adi-48708667.pdf; ComponentLink7Description: https://datasheet.ciiva.com/48708/001248351-da-01-en-ic-txrx-rs485-i-adm2582ebrwz-soic-20-adi-48708667.pdf
X2 = Header 4: CONN HEADER RT ANG 4POS 5.08MM; Manufacturer: Phoenix Contact; Industrial packaging: Yes; Number of contacts: 4; Content: 250 pc(s); Supplier 1: Digi-Key; Supplier Part Number 1: 277-1108-ND; Manufacturer Part Number: 1757268; Stock 1: 4206; Pricing 1: 1=1.27, 10=1.219, 50=1.166, 100=1.1342, 250=1.06, 500=0.9752, 1000=0.901, 2500=0.8586, 5000=0.8056 (USD); Type: MSTBA 2,5/ 4-G-5,08; Colour: Green; Pitch: 5.08 mm; Manufacturer part No.: 1757268; ComponentLink1URL: https://datasheet.ciiva.com/7630/1697153-7630841.pdf; ComponentLink1Description: https://datasheet.ciiva.com/7630/1697153-7630841.pdf; ComponentLink2URL: https://datasheet.ciiva.com/795/1757268-795434.pdf; ComponentLink2Description: https://datasheet.ciiva.com/795/1757268-795434.pdf; ComponentLink3URL: https://datasheet.ciiva.com/15197/getdatasheetpartid-176352-15197330.pdf; ComponentLink3Description: https://datasheet.ciiva.com/15197/getdatasheetpartid-176352-15197330.pdf; ComponentLink4URL: https://datasheet.ciiva.com/16096/1757268-16096406.pdf; ComponentLink4Description: https://datasheet.ciiva.com/16096/1757268-16096406.pdf; ComponentLink5URL: https://datasheet.ciiva.com/29210/569323-da-01-en-grundgehaeuse-1757268-250-st-29210575.pdf; ComponentLink5Description: https://datasheet.ciiva.com/29210/569323-da-01-en-grundgehaeuse-1757268-250-st-29210575.pdf; ComponentLink6URL: https://datasheet.ciiva.com/16703/70054631-16703596.pdf; ComponentLink6Description: https://datasheet.ciiva.com/16703/70054631-16703596.pdf

## Assembly variants
default: all parts fitted